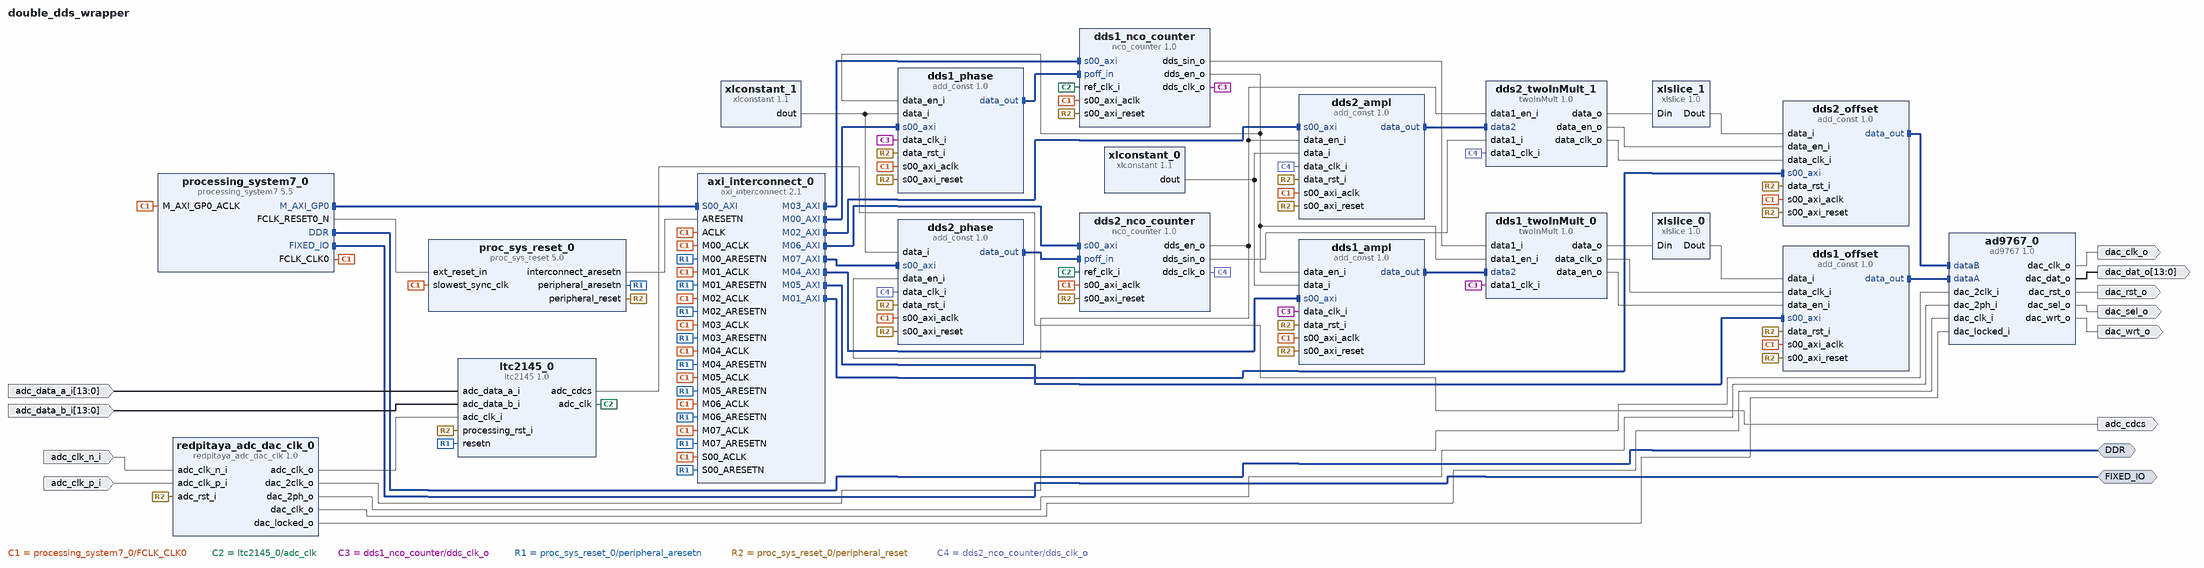
[diagram p0: block diagram of the top level]
# Vivado block design double_dds_wrapper, xc7z010clg400-1, Vivado 2016.4
create_bd_design double_dds_wrapper

create_bd_intf_port -mode Master -vlnv xilinx.com:interface:ddrx_rtl:1.0 DDR
create_bd_intf_port -mode Master -vlnv xilinx.com:display_processing_system7:fixedio_rtl:1.0 FIXED_IO
create_bd_port -dir O dac_clk_o
create_bd_port -dir O -from 13 -to 0 dac_dat_o
create_bd_port -dir O dac_rst_o
create_bd_port -dir O dac_sel_o
create_bd_port -dir O dac_wrt_o
create_bd_port -dir I adc_clk_n_i
create_bd_port -dir I adc_clk_p_i
create_bd_port -dir I -from 13 -to 0 adc_data_a_i
create_bd_port -dir I -from 13 -to 0 adc_data_b_i
create_bd_port -dir O adc_cdcs

create_bd_cell -type ip -vlnv ggm:cogen:ad9767:1.0 ad9767_0
create_bd_cell -type ip -vlnv xilinx.com:ip:axi_interconnect:2.1 axi_interconnect_0
set_property -dict {CONFIG.NUM_MI 8} [get_bd_cells axi_interconnect_0]
create_bd_cell -type ip -vlnv ggm:cogen:add_const:1.0 dds1_ampl
set_property -dict {CONFIG.format unsigned CONFIG.DATA_OUT_SIZE 14 CONFIG.DATA_IN_SIZE 14} [get_bd_cells dds1_ampl]
create_bd_cell -type ip -vlnv ggm:cogen:add_const:1.0 dds1_offset
set_property -dict {CONFIG.DATA_OUT_SIZE 14 CONFIG.DATA_IN_SIZE 14} [get_bd_cells dds1_offset]
create_bd_cell -type ip -vlnv gwbs:user:ltc2145:1.0 ltc2145_0
create_bd_cell -type ip -vlnv xilinx.com:ip:proc_sys_reset:5.0 proc_sys_reset_0
create_bd_cell -type ip -vlnv xilinx.com:ip:processing_system7:5.5 processing_system7_0
set_property -dict [list \
  CONFIG.PCW_FCLK_CLK1_BUF TRUE \
  CONFIG.PCW_FCLK_CLK2_BUF TRUE \
  CONFIG.PCW_FCLK_CLK3_BUF TRUE \
  CONFIG.PCW_UIPARAM_DDR_FREQ_MHZ 533.333333 \
  CONFIG.PCW_APU_PERIPHERAL_FREQMHZ 666.666666 \
  CONFIG.PCW_QSPI_PERIPHERAL_FREQMHZ 125 \
  CONFIG.PCW_SDIO_PERIPHERAL_FREQMHZ 125 \
  CONFIG.PCW_UART_PERIPHERAL_FREQMHZ 100 \
  CONFIG.PCW_I2C_PERIPHERAL_FREQMHZ 111.111115 \
  CONFIG.PCW_FPGA0_PERIPHERAL_FREQMHZ 125 \
  CONFIG.PCW_FPGA1_PERIPHERAL_FREQMHZ 250 \
  CONFIG.PCW_FPGA3_PERIPHERAL_FREQMHZ 200 \
  CONFIG.PCW_M_AXI_GP0_FREQMHZ 125 \
  CONFIG.PCW_EN_CLK1_PORT 1 \
  CONFIG.PCW_EN_CLK2_PORT 1 \
  CONFIG.PCW_EN_CLK3_PORT 1 \
  CONFIG.PCW_EN_RST1_PORT 1 \
  CONFIG.PCW_EN_RST2_PORT 1 \
  CONFIG.PCW_EN_RST3_PORT 1 \
  CONFIG.PCW_IRQ_F2P_MODE REVERSE \
  CONFIG.PCW_PERIPHERAL_BOARD_PRESET part0 \
  CONFIG.PCW_PRESET_BANK1_VOLTAGE {LVCMOS 2.5V} \
  CONFIG.PCW_UIPARAM_DDR_BUS_WIDTH {16 Bit} \
  CONFIG.PCW_UIPARAM_DDR_PARTNO {MT41J256M16 RE-125} \
  CONFIG.PCW_QSPI_PERIPHERAL_ENABLE 1 \
  CONFIG.PCW_QSPI_QSPI_IO {MIO 1 .. 6} \
  CONFIG.PCW_QSPI_GRP_SINGLE_SS_ENABLE 1 \
  CONFIG.PCW_QSPI_GRP_SINGLE_SS_IO {MIO 1 .. 6} \
  CONFIG.PCW_ENET0_PERIPHERAL_ENABLE 1 \
  CONFIG.PCW_ENET0_ENET0_IO {MIO 16 .. 27} \
  CONFIG.PCW_ENET0_GRP_MDIO_ENABLE 1 \
  CONFIG.PCW_ENET0_GRP_MDIO_IO {MIO 52 .. 53} \
  CONFIG.PCW_ENET_RESET_ENABLE 1 \
  CONFIG.PCW_ENET_RESET_SELECT {Share reset pin} \
  CONFIG.PCW_ENET0_RESET_ENABLE 0 \
  CONFIG.PCW_SD0_PERIPHERAL_ENABLE 1 \
  CONFIG.PCW_SD0_SD0_IO {MIO 40 .. 45} \
  CONFIG.PCW_SD0_GRP_CD_ENABLE 1 \
  CONFIG.PCW_SD0_GRP_CD_IO {MIO 46} \
  CONFIG.PCW_SD0_GRP_WP_ENABLE 1 \
  CONFIG.PCW_SD0_GRP_WP_IO {MIO 47} \
  CONFIG.PCW_UART0_PERIPHERAL_ENABLE 1 \
  CONFIG.PCW_UART0_UART0_IO {MIO 14 .. 15} \
  CONFIG.PCW_UART1_PERIPHERAL_ENABLE 1 \
  CONFIG.PCW_UART1_UART1_IO {MIO 8 .. 9} \
  CONFIG.PCW_SPI0_PERIPHERAL_ENABLE 1 \
  CONFIG.PCW_SPI0_SPI0_IO EMIO \
  CONFIG.PCW_SPI1_PERIPHERAL_ENABLE 1 \
  CONFIG.PCW_SPI1_SPI1_IO {MIO 10 .. 15} \
  CONFIG.PCW_TRACE_INTERNAL_WIDTH 32 \
  CONFIG.PCW_TTC0_PERIPHERAL_ENABLE 1 \
  CONFIG.PCW_TTC0_TTC0_IO EMIO \
  CONFIG.PCW_USB0_PERIPHERAL_ENABLE 1 \
  CONFIG.PCW_USB0_USB0_IO {MIO 28 .. 39} \
  CONFIG.PCW_USB_RESET_ENABLE 1 \
  CONFIG.PCW_USB_RESET_SELECT {Share reset pin} \
  CONFIG.PCW_USB0_RESET_ENABLE 1 \
  CONFIG.PCW_USB0_RESET_IO {MIO 48} \
  CONFIG.PCW_I2C0_PERIPHERAL_ENABLE 1 \
  CONFIG.PCW_I2C0_I2C0_IO {MIO 50 .. 51} \
  CONFIG.PCW_I2C0_GRP_INT_ENABLE 0 \
  CONFIG.PCW_I2C_RESET_ENABLE 1 \
  CONFIG.PCW_I2C_RESET_SELECT {Share reset pin} \
  CONFIG.PCW_GPIO_MIO_GPIO_ENABLE 1 \
  CONFIG.PCW_GPIO_MIO_GPIO_IO MIO \
  CONFIG.PCW_DCI_PERIPHERAL_CLKSRC 1 \
  CONFIG.PCW_PCAP_PERIPHERAL_CLKSRC 1 \
  CONFIG.PCW_FPGA_FCLK1_ENABLE 1 \
  CONFIG.PCW_FPGA_FCLK2_ENABLE 1 \
  CONFIG.PCW_FPGA_FCLK3_ENABLE 1 \
] [get_bd_cells processing_system7_0]
# 496 more settings of processing_system7_0 are not shown: defaults, MIO pin electricals, DDR timing, and values the tool derives
create_bd_cell -type ip -vlnv ggm:cogen:redpitaya_adc_dac_clk:1.0 redpitaya_adc_dac_clk_0
create_bd_cell -type ip -vlnv ggm:cogen:twoInMult:1.0 dds1_twoInMult_0
set_property -dict {CONFIG.DATA_SIZE 14} [get_bd_cells dds1_twoInMult_0]
create_bd_cell -type ip -vlnv xilinx.com:ip:xlconstant:1.1 xlconstant_0
set_property -dict {CONFIG.CONST_WIDTH 14 CONFIG.CONST_VAL 0} [get_bd_cells xlconstant_0]
create_bd_cell -type ip -vlnv xilinx.com:ip:xlslice:1.0 xlslice_0
set_property -dict {CONFIG.DOUT_WIDTH 14 CONFIG.DIN_TO 13 CONFIG.DIN_FROM 26 CONFIG.DIN_WIDTH 28} [get_bd_cells xlslice_0]
create_bd_cell -type ip -vlnv ggm:cogen:add_const:1.0 dds1_phase
set_property -dict {CONFIG.format unsigned CONFIG.DATA_OUT_SIZE 16 CONFIG.DATA_IN_SIZE 16} [get_bd_cells dds1_phase]
create_bd_cell -type ip -vlnv xilinx.com:ip:xlconstant:1.1 xlconstant_1
set_property -dict {CONFIG.CONST_WIDTH 16 CONFIG.CONST_VAL 0} [get_bd_cells xlconstant_1]
create_bd_cell -type ip -vlnv ggm:cogen:add_const:1.0 dds2_offset
set_property -dict {CONFIG.DATA_OUT_SIZE 14 CONFIG.DATA_IN_SIZE 14} [get_bd_cells dds2_offset]
create_bd_cell -type ip -vlnv xilinx.com:ip:xlslice:1.0 xlslice_1
set_property -dict {CONFIG.DOUT_WIDTH 14 CONFIG.DIN_TO 13 CONFIG.DIN_FROM 26 CONFIG.DIN_WIDTH 28} [get_bd_cells xlslice_1]
create_bd_cell -type ip -vlnv ggm:cogen:twoInMult:1.0 dds2_twoInMult_1
set_property -dict {CONFIG.DATA_SIZE 14} [get_bd_cells dds2_twoInMult_1]
create_bd_cell -type ip -vlnv ggm:cogen:add_const:1.0 dds2_ampl
set_property -dict {CONFIG.format unsigned CONFIG.DATA_OUT_SIZE 14 CONFIG.DATA_IN_SIZE 14} [get_bd_cells dds2_ampl]
create_bd_cell -type ip -vlnv ggm:cogen:add_const:1.0 dds2_phase
set_property -dict {CONFIG.format unsigned CONFIG.DATA_OUT_SIZE 16 CONFIG.DATA_IN_SIZE 16} [get_bd_cells dds2_phase]
create_bd_cell -type ip -vlnv user.org:user:nco_counter:1.0 dds1_nco_counter
set_property -dict {CONFIG.DATA_SIZE 14 CONFIG.COUNTER_SIZE 32 CONFIG.LUT_SIZE 12} [get_bd_cells dds1_nco_counter]
create_bd_cell -type ip -vlnv user.org:user:nco_counter:1.0 dds2_nco_counter
set_property -dict {CONFIG.DATA_SIZE 14 CONFIG.COUNTER_SIZE 32 CONFIG.LUT_SIZE 12} [get_bd_cells dds2_nco_counter]

# ---- connections ----

connect_bd_intf_net [get_bd_intf_pins axi_interconnect_0/S00_AXI] [get_bd_intf_pins processing_system7_0/M_AXI_GP0]
connect_bd_intf_net -intf_net add_const_2_data_out [get_bd_intf_pins dds1_twoInMult_0/data2] [get_bd_intf_pins dds1_ampl/data_out]
connect_bd_intf_net -intf_net add_const_3_data_out [get_bd_intf_pins ad9767_0/dataA] [get_bd_intf_pins dds1_offset/data_out]
connect_bd_intf_net [get_bd_intf_pins axi_interconnect_0/M04_AXI] [get_bd_intf_pins dds1_ampl/s00_axi]
connect_bd_intf_net [get_bd_intf_pins axi_interconnect_0/M05_AXI] [get_bd_intf_pins dds1_offset/s00_axi]
connect_bd_intf_net [get_bd_intf_pins axi_interconnect_0/M00_AXI] [get_bd_intf_pins dds1_phase/s00_axi]
connect_bd_intf_net [get_bd_intf_pins axi_interconnect_0/M01_AXI] [get_bd_intf_pins dds2_offset/s00_axi]
connect_bd_intf_net [get_bd_intf_pins dds2_offset/data_out] [get_bd_intf_pins ad9767_0/dataB]
connect_bd_intf_net [get_bd_intf_pins axi_interconnect_0/M02_AXI] [get_bd_intf_pins dds2_ampl/s00_axi]
connect_bd_intf_net -intf_net dds1_ampl1_data_out [get_bd_intf_pins dds2_ampl/data_out] [get_bd_intf_pins dds2_twoInMult_1/data2]
connect_bd_intf_net [get_bd_intf_pins axi_interconnect_0/M07_AXI] [get_bd_intf_pins dds2_phase/s00_axi]
connect_bd_intf_net [get_bd_intf_pins axi_interconnect_0/M03_AXI] [get_bd_intf_pins dds1_nco_counter/s00_axi]
connect_bd_intf_net [get_bd_intf_pins dds1_phase/data_out] [get_bd_intf_pins dds1_nco_counter/poff_in]
connect_bd_intf_net [get_bd_intf_pins axi_interconnect_0/M06_AXI] [get_bd_intf_pins dds2_nco_counter/s00_axi]
connect_bd_intf_net [get_bd_intf_pins dds2_phase/data_out] [get_bd_intf_pins dds2_nco_counter/poff_in]
connect_bd_intf_net [get_bd_intf_ports DDR] [get_bd_intf_pins processing_system7_0/DDR]
connect_bd_intf_net [get_bd_intf_ports FIXED_IO] [get_bd_intf_pins processing_system7_0/FIXED_IO]
connect_bd_net -net ACLK_1 [get_bd_pins processing_system7_0/FCLK_CLK0] \
  [get_bd_pins proc_sys_reset_0/slowest_sync_clk] [get_bd_pins processing_system7_0/M_AXI_GP0_ACLK] \
  [get_bd_pins dds1_ampl/s00_axi_aclk] [get_bd_pins dds1_offset/s00_axi_aclk] [get_bd_pins dds1_phase/s00_axi_aclk] \
  [get_bd_pins dds2_offset/s00_axi_aclk] [get_bd_pins dds2_ampl/s00_axi_aclk] [get_bd_pins dds2_phase/s00_axi_aclk] \
  [get_bd_pins dds1_nco_counter/s00_axi_aclk] [get_bd_pins dds2_nco_counter/s00_axi_aclk] \
  [get_bd_pins axi_interconnect_0/ACLK] [get_bd_pins axi_interconnect_0/S00_ACLK] [get_bd_pins axi_interconnect_0/M00_ACLK] \
  [get_bd_pins axi_interconnect_0/M01_ACLK] [get_bd_pins axi_interconnect_0/M02_ACLK] \
  [get_bd_pins axi_interconnect_0/M03_ACLK] [get_bd_pins axi_interconnect_0/M04_ACLK] \
  [get_bd_pins axi_interconnect_0/M05_ACLK] [get_bd_pins axi_interconnect_0/M06_ACLK] \
  [get_bd_pins axi_interconnect_0/M07_ACLK]
connect_bd_net [get_bd_pins ad9767_0/dac_clk_o] [get_bd_ports dac_clk_o]
connect_bd_net [get_bd_pins ad9767_0/dac_dat_o] [get_bd_ports dac_dat_o]
connect_bd_net [get_bd_pins ad9767_0/dac_rst_o] [get_bd_ports dac_rst_o]
connect_bd_net [get_bd_pins ad9767_0/dac_sel_o] [get_bd_ports dac_sel_o]
connect_bd_net [get_bd_pins ad9767_0/dac_wrt_o] [get_bd_ports dac_wrt_o]
connect_bd_net [get_bd_ports adc_clk_n_i] [get_bd_pins redpitaya_adc_dac_clk_0/adc_clk_n_i]
connect_bd_net [get_bd_ports adc_clk_p_i] [get_bd_pins redpitaya_adc_dac_clk_0/adc_clk_p_i]
connect_bd_net [get_bd_ports adc_data_a_i] [get_bd_pins ltc2145_0/adc_data_a_i]
connect_bd_net [get_bd_ports adc_data_b_i] [get_bd_pins ltc2145_0/adc_data_b_i]
connect_bd_net [get_bd_pins ltc2145_0/adc_cdcs] [get_bd_ports adc_cdcs]
connect_bd_net [get_bd_pins ltc2145_0/adc_clk] [get_bd_pins dds1_nco_counter/ref_clk_i] [get_bd_pins dds2_nco_counter/ref_clk_i]
connect_bd_net -net nco_counter_0_dds_clk_o [get_bd_pins dds1_nco_counter/dds_clk_o] \
  [get_bd_pins dds1_ampl/data_clk_i] [get_bd_pins dds1_twoInMult_0/data1_clk_i] [get_bd_pins dds1_phase/data_clk_i]
connect_bd_net -net nco_counter_0_dds_en_o [get_bd_pins dds1_nco_counter/dds_en_o] \
  [get_bd_pins dds1_ampl/data_en_i] [get_bd_pins dds1_twoInMult_0/data1_en_i] [get_bd_pins dds1_phase/data_en_i]
connect_bd_net [get_bd_pins proc_sys_reset_0/interconnect_aresetn] [get_bd_pins axi_interconnect_0/ARESETN]
connect_bd_net [get_bd_pins proc_sys_reset_0/peripheral_aresetn] \
  [get_bd_pins ltc2145_0/resetn] [get_bd_pins axi_interconnect_0/S00_ARESETN] [get_bd_pins axi_interconnect_0/M00_ARESETN] \
  [get_bd_pins axi_interconnect_0/M01_ARESETN] [get_bd_pins axi_interconnect_0/M02_ARESETN] \
  [get_bd_pins axi_interconnect_0/M03_ARESETN] [get_bd_pins axi_interconnect_0/M04_ARESETN] \
  [get_bd_pins axi_interconnect_0/M05_ARESETN] [get_bd_pins axi_interconnect_0/M06_ARESETN] \
  [get_bd_pins axi_interconnect_0/M07_ARESETN]
connect_bd_net [get_bd_pins proc_sys_reset_0/peripheral_reset] \
  [get_bd_pins redpitaya_adc_dac_clk_0/adc_rst_i] [get_bd_pins dds1_ampl/s00_axi_reset] [get_bd_pins dds1_ampl/data_rst_i] \
  [get_bd_pins dds1_offset/s00_axi_reset] [get_bd_pins dds1_offset/data_rst_i] [get_bd_pins ltc2145_0/processing_rst_i] \
  [get_bd_pins dds1_phase/s00_axi_reset] [get_bd_pins dds1_phase/data_rst_i] [get_bd_pins dds2_offset/s00_axi_reset] \
  [get_bd_pins dds2_offset/data_rst_i] [get_bd_pins dds2_ampl/s00_axi_reset] [get_bd_pins dds2_ampl/data_rst_i] \
  [get_bd_pins dds2_phase/s00_axi_reset] [get_bd_pins dds2_phase/data_rst_i] [get_bd_pins dds1_nco_counter/s00_axi_reset] \
  [get_bd_pins dds2_nco_counter/s00_axi_reset]
connect_bd_net [get_bd_pins processing_system7_0/FCLK_RESET0_N] [get_bd_pins proc_sys_reset_0/ext_reset_in]
connect_bd_net [get_bd_pins redpitaya_adc_dac_clk_0/adc_clk_o] [get_bd_pins ltc2145_0/adc_clk_i]
connect_bd_net [get_bd_pins redpitaya_adc_dac_clk_0/dac_2clk_o] [get_bd_pins ad9767_0/dac_2clk_i]
connect_bd_net [get_bd_pins redpitaya_adc_dac_clk_0/dac_2ph_o] [get_bd_pins ad9767_0/dac_2ph_i]
connect_bd_net [get_bd_pins redpitaya_adc_dac_clk_0/dac_clk_o] [get_bd_pins ad9767_0/dac_clk_i]
connect_bd_net [get_bd_pins redpitaya_adc_dac_clk_0/dac_locked_o] [get_bd_pins ad9767_0/dac_locked_i]
connect_bd_net -net twoInMult_0_data_clk_o [get_bd_pins dds1_twoInMult_0/data_clk_o] [get_bd_pins dds1_offset/data_clk_i]
connect_bd_net -net twoInMult_0_data_en_o [get_bd_pins dds1_twoInMult_0/data_en_o] [get_bd_pins dds1_offset/data_en_i]
connect_bd_net -net twoInMult_0_data_o [get_bd_pins dds1_twoInMult_0/data_o] [get_bd_pins xlslice_0/Din]
connect_bd_net [get_bd_pins xlconstant_0/dout] [get_bd_pins dds1_ampl/data_i] [get_bd_pins dds2_ampl/data_i]
connect_bd_net [get_bd_pins xlslice_0/Dout] [get_bd_pins dds1_offset/data_i]
connect_bd_net [get_bd_pins xlconstant_1/dout] [get_bd_pins dds1_phase/data_i] [get_bd_pins dds2_phase/data_i]
connect_bd_net [get_bd_pins xlslice_1/Dout] [get_bd_pins dds2_offset/data_i]
connect_bd_net -net dds1_twoInMult_1_data_o [get_bd_pins dds2_twoInMult_1/data_o] [get_bd_pins xlslice_1/Din]
connect_bd_net -net dds1_twoInMult_1_data_en_o [get_bd_pins dds2_twoInMult_1/data_en_o] [get_bd_pins dds2_offset/data_en_i]
connect_bd_net -net dds1_twoInMult_1_data_clk_o [get_bd_pins dds2_twoInMult_1/data_clk_o] [get_bd_pins dds2_offset/data_clk_i]
connect_bd_net -net dds1_nco_counter1_dds_en_o [get_bd_pins dds2_nco_counter/dds_en_o] \
  [get_bd_pins dds2_twoInMult_1/data1_en_i] [get_bd_pins dds2_phase/data_en_i] [get_bd_pins dds2_ampl/data_en_i]
connect_bd_net -net dds1_nco_counter1_dds_clk_o [get_bd_pins dds2_nco_counter/dds_clk_o] \
  [get_bd_pins dds2_twoInMult_1/data1_clk_i] [get_bd_pins dds2_phase/data_clk_i] [get_bd_pins dds2_ampl/data_clk_i]
connect_bd_net -net nco_counter_0_dds_sin_o [get_bd_pins dds1_nco_counter/dds_sin_o] [get_bd_pins dds1_twoInMult_0/data1_i]
connect_bd_net -net dds1_nco_counter1_dds_sin_o [get_bd_pins dds2_nco_counter/dds_sin_o] [get_bd_pins dds2_twoInMult_1/data1_i]

# ---- address map ----
assign_bd_address -offset 0x43C00000 -range 64K -target_address_space [get_bd_addr_spaces processing_system7_0/Data] [get_bd_addr_segs dds1_phase/s00_axi/reg0]
assign_bd_address -offset 0x43C10000 -range 64K -target_address_space [get_bd_addr_spaces processing_system7_0/Data] [get_bd_addr_segs dds2_offset/s00_axi/reg0]
assign_bd_address -offset 0x43C20000 -range 64K -target_address_space [get_bd_addr_spaces processing_system7_0/Data] [get_bd_addr_segs dds2_ampl/s00_axi/reg0]
assign_bd_address -offset 0x43C30000 -range 64K -target_address_space [get_bd_addr_spaces processing_system7_0/Data] [get_bd_addr_segs dds1_nco_counter/s00_axi/reg0]
assign_bd_address -offset 0x43C40000 -range 64K -target_address_space [get_bd_addr_spaces processing_system7_0/Data] [get_bd_addr_segs dds1_ampl/s00_axi/reg0]
assign_bd_address -offset 0x43C50000 -range 64K -target_address_space [get_bd_addr_spaces processing_system7_0/Data] [get_bd_addr_segs dds1_offset/s00_axi/reg0]
assign_bd_address -offset 0x43C60000 -range 64K -target_address_space [get_bd_addr_spaces processing_system7_0/Data] [get_bd_addr_segs dds2_nco_counter/s00_axi/reg0]
assign_bd_address -offset 0x43C70000 -range 64K -target_address_space [get_bd_addr_spaces processing_system7_0/Data] [get_bd_addr_segs dds2_phase/s00_axi/reg0]

validate_bd_design
save_bd_design
